# Altium project exchange_PCB.PrjPcb
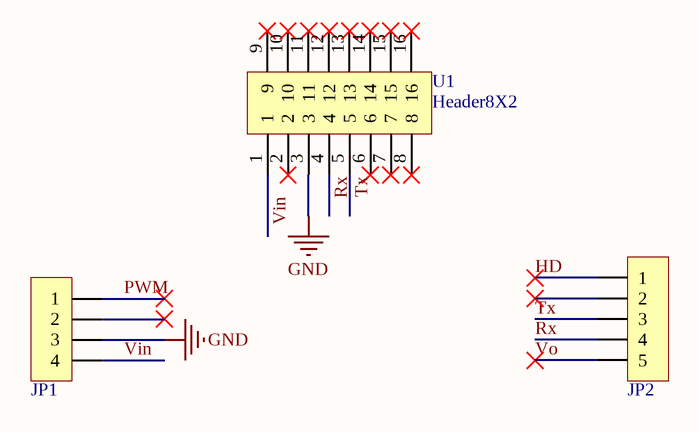
[diagram p0: exchange_pcb.SchDoc]
1 sheet, 3 parts. Net scope: global (net labels, ports and power ports of the same name join across sheets).
Board file: exchange_pcbV2.PcbDoc

## Sheet exchange_pcb.SchDoc
size A1; SheetNumber: 1; SheetTotal: 1

### Parts
JP1  HDR-1X4  [HDR2.54-M-LI-4P]  (value not drawn)
JP2  HDR-1X5  [HDR2.54-M-LI-5P]  (value not drawn)
U1  Header8X2  [header8X2]

### Nets
GND: JP1.3 U1.3
HD: JP2.1
PWM: JP1.1
Rx: JP2.4 U1.4
Tx: JP2.3 U1.5
Vin: JP1.4 U1.1
Vo: JP2.5

Not connected (* = marked no-connect by the designer): JP1 2*; JP2 2*; U1 2* 6* 7* 8* 9* 10* 11* 12* 13* 14* 15* 16*

### Library data of the parts
JP1 = Header 4: 4P接插件; 版权归属: 封装库来自淘宝 ID：黄晶宝石; BOM名称: 4P接插件; 学习资源: https://shop463601444.taobao.com
JP2 = Header 5: 5P接插件; 版权归属: 封装库来自淘宝 ID：黄晶宝石; BOM名称: 5P接插件; 学习资源: https://shop463601444.taobao.com